# Altium project Sensor_PCB.PrjPcb
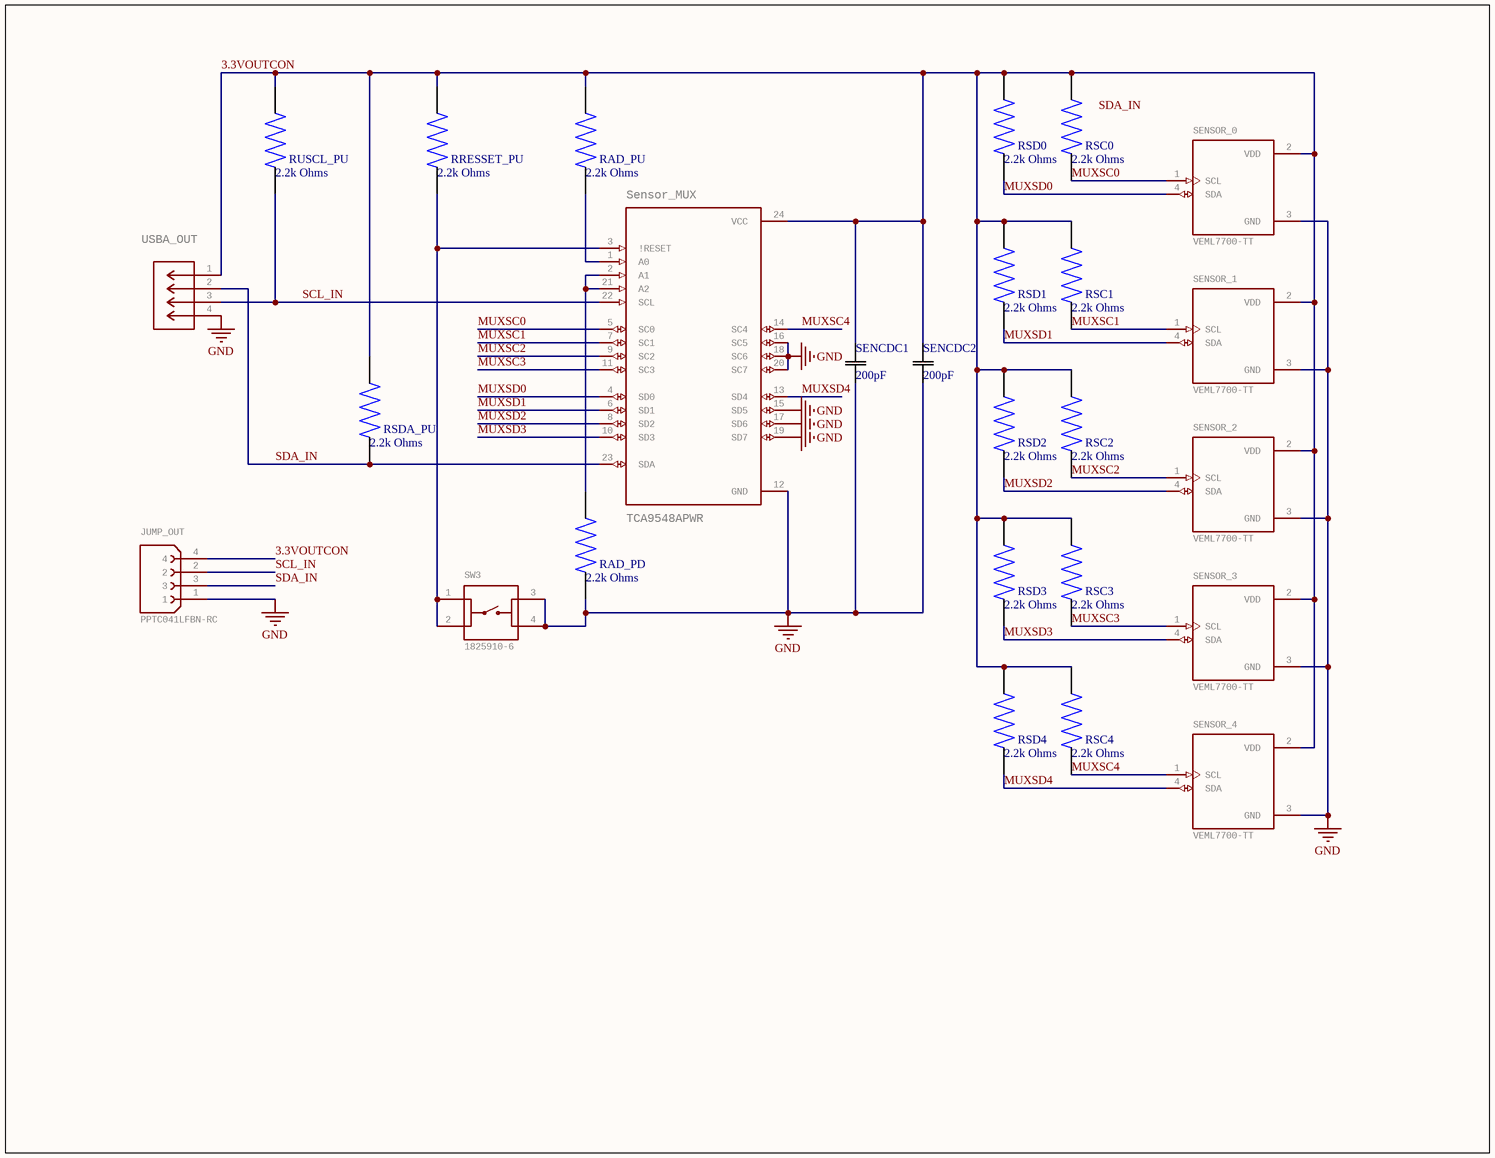
[diagram p0: Sensor_PCB.SchDoc]
1 sheet, 26 parts. Net scope: global (net labels, ports and power ports of the same name join across sheets).
Board file: Sensor_PCB.PcbDoc

## Sheet Sensor_PCB.SchDoc
size Letter; SheetNumber: 1; SheetTotal: 1

### Parts
JUMP_OUT  PPTC041LFBN-RC  [SULLINS_PPTC041LFBN-RC]
RAD_PD  2.2k Ohms  [RESC2012X60N]
RAD_PU  2.2k Ohms  [RESC2012X60N]
RRESSET_PU  2.2k Ohms  [RESC2012X60N]
RSC0  2.2k Ohms  [RESC2012X60N]
RSC1  2.2k Ohms  [RESC2012X60N]
RSC2  2.2k Ohms  [RESC2012X60N]
RSC3  2.2k Ohms  [RESC2012X60N]
RSC4  2.2k Ohms  [RESC2012X60N]
RSD0  2.2k Ohms  [RESC2012X60N]
RSD1  2.2k Ohms  [RESC2012X60N]
RSD2  2.2k Ohms  [RESC2012X60N]
RSD3  2.2k Ohms  [RESC2012X60N]
RSD4  2.2k Ohms  [RESC2012X60N]
RSDA_PU  2.2k Ohms  [RESC2012X60N]
RUSCL_PU  2.2k Ohms  [RESC2012X60N]
SENCDC1  200pF  [CAP_CC0805_YAG]
SENCDC2  200pF  [CAP_CC0805_YAG]
SENSOR_0  VEML7700-TT  [XDCR_VEML7700-TT]
SENSOR_1  VEML7700-TT  [XDCR_VEML7700-TT]
SENSOR_2  VEML7700-TT  [XDCR_VEML7700-TT]
SENSOR_3  VEML7700-TT  [XDCR_VEML7700-TT]
SENSOR_4  VEML7700-TT  [XDCR_VEML7700-TT]
Sensor_MUX  TCA9548APWR  [SOP65P640X120-24N]
SW3  1825910-6  [SW_1825910-6-4]
USBA_OUT  USB-AP-S-RA-SMT  [CONN_USB-AP-S-RA-SMT_ADM]  (value not drawn)

### Nets
GND: JUMP_OUT.1 RAD_PD.1 SENCDC1.1 SENCDC2.1 SENSOR_0.3(GND) SENSOR_1.3(GND) SENSOR_2.3(GND) SENSOR_3.3(GND) SENSOR_4.3(GND) Sensor_MUX.12(GND) Sensor_MUX.15(SD5) Sensor_MUX.16(SC5) Sensor_MUX.17(SD6) Sensor_MUX.18(SC6) Sensor_MUX.19(SD7) Sensor_MUX.20(SC7) SW3.3 SW3.4 USBA_OUT.4
3.3VOUTCON: JUMP_OUT.4 RAD_PU.2 RRESSET_PU.2 RSC0.2 RSC1.2 RSC2.2 RSC3.2 RSC4.2 RSD0.2 RSD1.2 RSD2.2 RSD3.2 RSD4.2 RSDA_PU.2 RUSCL_PU.2 SENCDC1.2 SENCDC2.2 SENSOR_0.2(VDD) SENSOR_1.2(VDD) SENSOR_2.2(VDD) SENSOR_3.2(VDD) SENSOR_4.2(VDD) Sensor_MUX.24(VCC) USBA_OUT.1
MUXSC0: RSC0.1 SENSOR_0.1(SCL) Sensor_MUX.5(SC0)
MUXSC1: RSC1.1 SENSOR_1.1(SCL) Sensor_MUX.7(SC1)
MUXSC2: RSC2.1 SENSOR_2.1(SCL) Sensor_MUX.9(SC2)
MUXSC3: RSC3.1 SENSOR_3.1(SCL) Sensor_MUX.11(SC3)
MUXSC4: RSC4.1 SENSOR_4.1(SCL) Sensor_MUX.14(SC4)
MUXSD0: RSD0.1 SENSOR_0.4(SDA) Sensor_MUX.4(SD0)
MUXSD1: RSD1.1 SENSOR_1.4(SDA) Sensor_MUX.6(SD1)
MUXSD2: RSD2.1 SENSOR_2.4(SDA) Sensor_MUX.8(SD2)
MUXSD3: RSD3.1 SENSOR_3.4(SDA) Sensor_MUX.10(SD3)
MUXSD4: RSD4.1 SENSOR_4.4(SDA) Sensor_MUX.13(SD4)
SCL_IN: JUMP_OUT.2 RUSCL_PU.1 Sensor_MUX.22(SCL) USBA_OUT.3
SDA_IN: JUMP_OUT.3 RSDA_PU.1 Sensor_MUX.23(SDA) USBA_OUT.2
NetRAD_PD_2: RAD_PD.2 Sensor_MUX.2(A1) Sensor_MUX.21(A2)
NetRAD_PU_1: RAD_PU.1 Sensor_MUX.1(A0)
NetRRESSET_PU_1: RRESSET_PU.1 Sensor_MUX.3(!RESET) SW3.1 SW3.2

### Notes on the sheet
- Labels drawn without touching a wire or pin: SDA_IN

### Library data of the parts
JUMP_OUT = PPTC041LFBN-RC: 4 Position Header Connector Through Hole  Check availability; GateName_1: G$1; MF: Sullins Connector; SymbolName_1: PPTC041LFBN-RC; LibraryName: PPTC041LFBN-RC; DeviceSetName: PPTC041LFBN-RC; AVAILABILITY: In Stock; CHECK_PRICES: https://www.snapeda.com/parts/PPTC041LFBN-RC/Sullins+Connector+Solutions/view-part/?ref=eda; MP: PPTC041LFBN-RC; PACKAGE: None; PRICE: None; PURCHASE-URL: https://www.snapeda.com/api/url_track_click_mouser/?unipart_id=285917&manufacturer=Sullins Connector&part_name=PPTC041LFBN-RC&search_term=pptc041lfbn-rc; SNAPEDA_LINK: https://www.snapeda.com/parts/PPTC041LFBN-RC/Sullins+Connector+Solutions/view-part/?ref=snap
RAD_PD RAD_PU RRESSET_PU RSC0-RSC4 RSD0-RSD4 RSDA_PU RUSCL_PU = AC0805FR-072K2L: RES SMD 2.2K OHM 1% 1/8W 0805; Package: None; Price: None; Value: *; MP: AC0805FR-072K2L; Availability: Unavailable
SENCDC1 SENCDC2 = CC0805KRX7R9BB201: CAP CER 200PF 50V X7R 0805; Mfr_Name: Yageo; Copyright: Copyright (C) 2023 Ultra Librarian. All rights reserved.; Manufacturer_Part_Number: CC0805KRX7R9BB201; RefDes: RefDes; Type: DEV
SENSOR_0-SENSOR_4 = VEML7700-TT: GateName_1: G$1; MF: Vishay Semiconductor; SymbolName_1: VEML7700-TT; LibraryName: VEML7700-TT; DeviceSetName: VEML7700-TT; Package: XDCR_VEML7700-TT; Package: SMD-4 Vishay Semiconductor; Price: None; Check_prices: https://www.snapeda.com/parts/VEML7700-TT/Vishay+Semiconductor+Opto+Division/view-part/?ref=eda; SnapEDA_Link: https://www.snapeda.com/parts/VEML7700-TT/Vishay+Semiconductor+Opto+Division/view-part/?ref=snap; MP: VEML7700-TT; Availability: In Stock; Purchase-URL: https://www.snapeda.com/api/url_track_click_mouser/?unipart_id=534245&manufacturer=Vishay Semiconductor&part_name=VEML7700-TT&search_term=veml7700
Sensor_MUX = TCA9548APWR: IC BUS SWITCH 1 X 8:1 24TSSOP; GateName_1: G$1; MF: Texas Instruments; SymbolName_1: TCA9548APWR; LibraryName: TCA9548APWR; DeviceSetName: TCA9548APWR; Package: SOP65P640X120-24N; Package: TSSOP-24 Texas Instruments; Price: None; Check_prices: https://www.snapeda.com/parts/TCA9548APWR/Texas+Instruments/view-part/?ref=eda; SnapEDA_Link: https://www.snapeda.com/parts/TCA9548APWR/Texas+Instruments/view-part/?ref=snap; MP: TCA9548APWR; Availability: In Stock; Purchase-URL: https://www.snapeda.com/api/url_track_click_mouser/?unipart_id=280817&manufacturer=Texas Instruments&part_name=TCA9548APWR&search_term=tca9548a
SW3 = 1825910-6: SWITCH TACTILE SPST-NO 0.05A 24V; GateName_1: G$1; MF: TE Connectivity; SymbolName_1: 1825910-6; LibraryName: 1825910-6; DeviceSetName: 1825910-6; Package: SW_1825910-6-4; Package: None; Price: None; Check_prices: https://www.snapeda.com/parts/1825910-6/TE+Connectivity+ALCOSWITCH+Switches/view-part/?ref=eda; SnapEDA_Link: https://www.snapeda.com/parts/1825910-6/TE+Connectivity+ALCOSWITCH+Switches/view-part/?ref=snap; MP: 1825910-6; Availability: In Stock; Purchase-URL: https://www.snapeda.com/api/url_track_click_mouser/?unipart_id=226996&manufacturer=TE Connectivity&part_name=1825910-6&search_term=1825910-6
USBA_OUT = USB-AP-S-RA-SMT: USB A 2.0, R/A, SMT, PLUG; MFR_NAME: ADAM TECHNOLOGIES INC; SymbolName_1: CONN_004P_000C_1; GateName_1: A; LibraryName: USB-AP-S-RA-SMT; DeviceSetName: USB-AP-S-RA-SMT; Package: CONN_USB-AP-S-RA-SMT_ADM; COPYRIGHT: Copyright (C) 2023 Ultra Librarian. All rights reserved.; MANUFACTURER_PART_NUMBER: USB-AP-S-RA-SMT